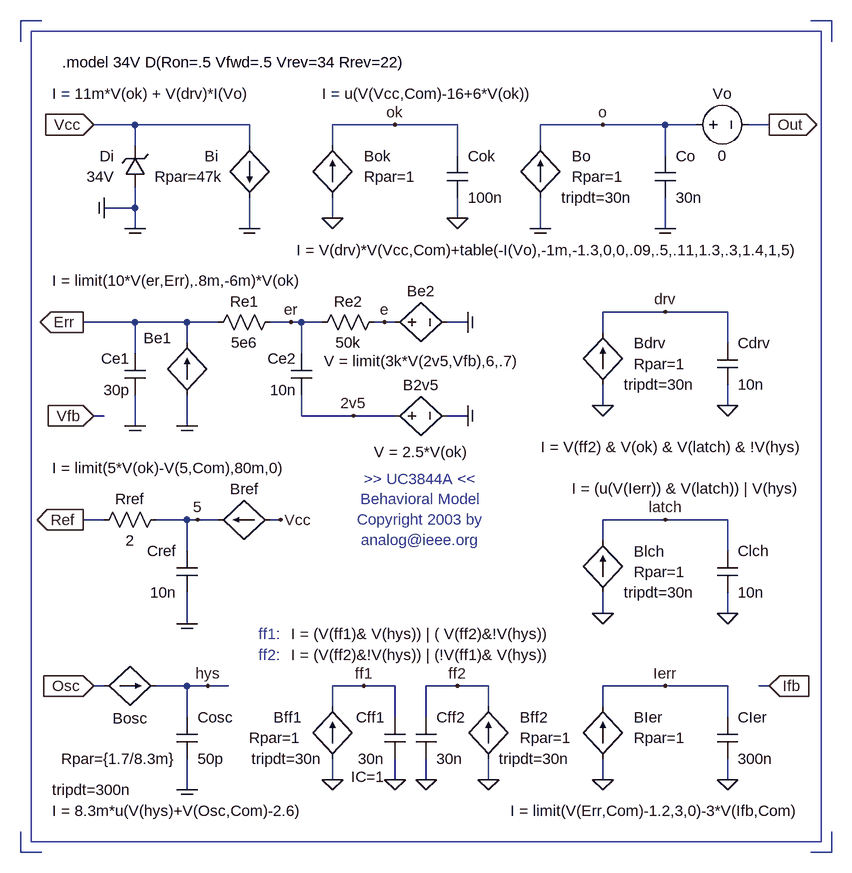
[diagram p0: schematic uc3844a.asc]
uc3844a.asc, the LTspice schematic file:
Version 4
SHEET 1 1792 932
WIRE -16 -208 16 -208
WIRE 496 96 592 96
WIRE -144 400 -144 352
WIRE -144 352 -192 352
WIRE -144 512 -144 464
WIRE 496 128 496 96
WIRE 496 208 496 240
WIRE 688 144 688 96
WIRE 688 240 688 208
WIRE 592 96 688 96
WIRE 80 -512 176 -512
WIRE 80 -480 80 -512
WIRE 80 -400 80 -368
WIRE 272 -464 272 -512
WIRE 272 -368 272 -400
WIRE 176 -512 272 -512
WIRE 496 -112 496 -80
WIRE 688 -176 688 -224
WIRE 688 -80 688 -112
WIRE 496 -224 592 -224
WIRE 496 -224 496 -192
WIRE 496 352 592 352
WIRE 496 384 496 352
WIRE 496 464 496 496
WIRE 688 400 688 352
WIRE 688 496 688 464
WIRE 592 352 688 352
WIRE -48 -512 -48 -480
WIRE -48 -400 -48 -352
WIRE -224 -480 -224 -512
WIRE -224 -512 -48 -512
WIRE -224 -416 -224 -384
WIRE -224 -512 -288 -512
WIRE -272 352 -288 352
WIRE -272 -384 -224 -384
WIRE 752 352 736 352
WIRE -272 96 -304 96
WIRE -144 96 -192 96
WIRE -144 144 -144 96
WIRE -144 256 -144 208
WIRE -288 -64 -272 -64
WIRE 752 -512 720 -512
WIRE 400 -480 400 -512
WIRE 400 -400 400 -352
WIRE 592 -224 688 -224
WIRE -144 -176 -144 -208
WIRE -144 -208 -224 -208
WIRE -144 -96 -144 -48
WIRE 32 -64 32 -96
WIRE 32 -160 32 -208
WIRE 144 -208 160 -208
WIRE 16 -208 32 -208
WIRE 32 -208 64 -208
WIRE -96 -208 -144 -208
WIRE 32 -64 112 -64
WIRE 256 -64 288 -64
WIRE 256 -208 288 -208
WIRE -400 -640 -400 -672
WIRE -400 -672 -368 -672
WIRE -400 576 -400 608
WIRE -400 608 -368 608
WIRE 816 608 848 608
WIRE 848 608 848 576
WIRE 816 -672 848 -672
WIRE 848 -672 848 -640
WIRE 592 -512 496 -512
WIRE 592 -464 592 -512
WIRE 592 -400 592 -352
WIRE -224 -160 -224 -208
WIRE -224 -208 -304 -208
WIRE -224 -96 -224 -48
WIRE 112 -64 176 -64
WIRE 640 -512 592 -512
WIRE 160 -208 176 -208
WIRE 496 -512 400 -512
WIRE -224 -384 -224 -352
WIRE -96 96 -128 96
WIRE -16 96 0 96
WIRE -144 352 -112 352
WIRE -128 96 -144 96
WIRE -112 352 -80 352
WIRE 80 384 80 352
WIRE 80 352 128 352
WIRE 176 352 176 400
WIRE 176 464 176 496
WIRE 80 496 80 464
WIRE 224 400 224 352
WIRE 224 352 272 352
WIRE 320 352 320 384
WIRE 272 352 320 352
WIRE 224 496 224 464
WIRE 320 496 320 464
WIRE 128 352 176 352
FLAG 16 -208 er
FLAG 592 96 latch
FLAG -112 352 hys
FLAG 496 240 0
FLAG 688 240 0
FLAG 176 -512 ok
FLAG 80 -368 0
FLAG 272 -368 0
FLAG 496 -80 0
FLAG 752 -512 Out
IOPIN 752 -512 Out
FLAG 688 -80 0
FLAG -288 -512 Vcc
IOPIN -288 -512 In
FLAG 592 352 Ierr
FLAG 496 496 0
FLAG 688 496 0
FLAG -304 96 Ref
IOPIN -304 96 Out
FLAG -288 352 Osc
IOPIN -288 352 In
FLAG -272 -384 Com
IOPIN -272 -384 In
FLAG 752 352 Ifb
IOPIN 752 352 In
FLAG -128 96 5
FLAG -304 -208 Err
IOPIN -304 -208 Out
FLAG -288 -64 Vfb
IOPIN -288 -64 In
FLAG 592 -224 drv
FLAG 112 -64 2v5
FLAG -144 512 COM
FLAG 496 -512 o
FLAG 160 -208 e
FLAG -224 -352 COM
FLAG 592 -352 COM
FLAG -224 -48 COM
FLAG -144 256 COM
FLAG 288 -208 COM
FLAG 288 -64 COM
FLAG -144 -48 COM
FLAG 400 -352 COM
FLAG 0 96 Vcc
FLAG -48 -352 COM
FLAG 80 496 0
FLAG 320 496 0
FLAG 224 496 0
FLAG 176 496 0
FLAG 128 352 ff1
FLAG 272 352 ff2
SYMBOL bi -144 -96 R180
WINDOW 0 24 88 Left 0
WINDOW 3 208 176 Right 0
SYMATTR InstName Be1
SYMATTR Value I = limit(10*V(er,Err),.8m,-6m)*V(ok)
SYMBOL bi -272 352 R270
WINDOW 0 -34 40 VBottom 0
WINDOW 3 -192 -80 VRight 0
WINDOW 123 -160 -80 VRight 0
SYMATTR InstName Bosc
SYMATTR Value I = 8.3m*u(V(hys)+V(Osc,Com)-2.6)
SYMATTR Value2 tripdt=300n
SYMBOL cap -160 400 R0
WINDOW 0 32 0 Left 0
WINDOW 3 32 64 Left 0
WINDOW 39 0 64 Right 0
SYMATTR InstName Cosc
SYMATTR Value 50p
SYMATTR SpiceLine Rpar={1.7/8.3m}
SYMBOL bi 496 -112 M180
WINDOW 0 48 64 Left 0
WINDOW 3 304 -96 Right 0
WINDOW 123 48 32 Left 0
WINDOW 39 32 0 Left 0
SYMATTR InstName Bdrv
SYMATTR Value I = V(ff2) & V(ok) & V(latch) & !V(hys)
SYMATTR Value2 Rpar=1
SYMATTR SpiceLine tripdt=30n
SYMBOL bi 496 208 M180
WINDOW 0 48 63 Left 0
WINDOW 3 304 160 Right 0
WINDOW 123 48 32 Left 0
WINDOW 39 32 0 Left 0
SYMATTR InstName Blch
SYMATTR Value I = (u(V(Ierr)) & V(latch)) | V(hys)
SYMATTR Value2 Rpar=1
SYMATTR SpiceLine tripdt=30n
SYMBOL cap 672 144 R0
WINDOW 0 32 0 Left 0
WINDOW 3 32 64 Left 0
SYMATTR InstName Clch
SYMATTR Value 10n
SYMBOL bi 80 -400 R180
WINDOW 0 -48 64 Right 0
WINDOW 3 16 160 Right 0
WINDOW 123 -48 32 Right 0
SYMATTR InstName Bok
SYMATTR Value I = u(V(Vcc,Com)-16+6*V(ok))
SYMATTR Value2 Rpar=1
SYMBOL cap 256 -464 R0
WINDOW 0 32 0 Left 0
WINDOW 3 32 64 Left 0
SYMATTR InstName Cok
SYMATTR Value 100n
SYMBOL cap 672 -176 R0
WINDOW 0 32 0 Left 0
WINDOW 3 32 64 Left 0
SYMATTR InstName Cdrv
SYMATTR Value 10n
SYMBOL bi 496 464 M180
WINDOW 0 48 64 Left 0
WINDOW 3 304 -80 Right 0
WINDOW 123 48 32 Left 0
SYMATTR InstName BIer
SYMATTR Value I = limit(V(Err,Com)-1.2,3,0)-3*V(Ifb,Com)
SYMATTR Value2 Rpar=1
SYMBOL cap 672 400 R0
WINDOW 0 32 0 Left 0
WINDOW 3 32 64 Left 0
SYMATTR InstName CIer
SYMATTR Value 300n
SYMBOL bi -48 -480 R0
WINDOW 0 -48 16 Right 0
WINDOW 3 -304 -80 Left 0
WINDOW 123 -40 48 Right 0
SYMATTR InstName Bi
SYMATTR Value I = 11m*V(ok) + V(drv)*I(Vo)
SYMATTR Value2 Rpar=47k
SYMBOL bi -16 96 R90
WINDOW 0 -32 40 VBottom 0
WINDOW 3 -80 336 VLeft 0
SYMATTR InstName Bref
SYMATTR Value I = limit(5*V(ok)-V(5,Com),80m,0)
SYMBOL res -176 80 R90
WINDOW 0 0 56 VBottom 0
WINDOW 3 32 56 VTop 0
SYMATTR InstName Rref
SYMATTR Value 2
SYMBOL cap -128 144 M0
WINDOW 0 32 0 Left 0
WINDOW 3 32 64 Left 0
SYMATTR InstName Cref
SYMATTR Value 10n
SYMBOL cap 48 -160 M0
SYMATTR InstName Ce2
SYMATTR Value 10n
SYMBOL bv 160 -208 R270
WINDOW 0 32 56 VTop 0
WINDOW 3 -44 56 VBottom 0
SYMATTR InstName Be2
SYMATTR Value V = limit(3k*V(2v5,Vfb),6,.7)
SYMBOL res 160 -224 R90
WINDOW 0 0 56 VBottom 0
WINDOW 3 32 56 VTop 0
SYMATTR InstName Re2
SYMATTR Value 50k
SYMBOL res 0 -224 R90
WINDOW 0 0 56 VBottom 0
WINDOW 3 32 56 VTop 0
SYMATTR InstName Re1
SYMATTR Value 5e6
SYMBOL bv 160 -64 R270
WINDOW 0 32 56 VTop 0
WINDOW 3 -40 56 VBottom 0
SYMATTR InstName B2v5
SYMATTR Value V = 2.5*V(ok)
SYMBOL zener -208 -416 R180
WINDOW 0 48 48 Left 0
WINDOW 3 48 16 Left 0
SYMATTR InstName Di
SYMATTR Value 34V
SYMBOL cap 576 -464 R0
WINDOW 0 32 0 Left 0
WINDOW 3 32 64 Left 0
SYMATTR InstName Co
SYMATTR Value 30n
SYMBOL cap -208 -160 M0
SYMATTR InstName Ce1
SYMATTR Value 30p
SYMBOL bi 400 -400 M180
WINDOW 0 48 64 Left 0
WINDOW 3 402 -81 Right 0
WINDOW 39 32 0 Left 0
WINDOW 123 48 32 Left 0
SYMATTR InstName Bo
SYMATTR Value I = V(drv)*V(Vcc,Com)+table(-I(Vo),-1m,-1.3,0,0,.09,.5,.11,1.3,.3,1.4,1,5)
SYMATTR SpiceLine tripdt=30n
SYMATTR Value2 Rpar=1
SYMBOL voltage 624 -512 R270
WINDOW 0 32 56 VTop 0
WINDOW 3 -32 56 VBottom 0
WINDOW 123 -32 56 VBottom 0
WINDOW 39 -32 56 VBottom 0
SYMATTR InstName Vo
SYMATTR Value 0
SYMBOL bi2 80 384 M0
WINDOW 123 16 80 Left 0
WINDOW 39 48 48 Left 0
WINDOW 0 48 16 Left 0
WINDOW 3 64 -112 Right 0
SYMATTR Value2 tripdt=30n
SYMATTR SpiceLine Rpar=1
SYMATTR InstName Bff1
SYMATTR Value I = (V(ff1)& V(hys)) | ( V(ff2)&!V(hys))
SYMBOL bi2 320 384 R0
WINDOW 123 16 80 Left 0
WINDOW 39 48 48 Left 0
WINDOW 0 48 16 Left 0
WINDOW 3 -304 -80 Left 0
SYMATTR Value2 tripdt=30n
SYMATTR SpiceLine Rpar=1
SYMATTR InstName Bff2
SYMATTR Value I = (V(ff2)&!V(hys)) | (!V(ff1)& V(hys))
SYMBOL cap 192 400 M0
WINDOW 0 32 0 Left 0
WINDOW 3 32 64 Left 0
WINDOW 123 32 92 Left 0
SYMATTR InstName Cff1
SYMATTR Value 30n
SYMATTR Value2 IC=1
SYMBOL cap 208 400 R0
WINDOW 0 32 0 Left 0
WINDOW 3 32 64 Left 0
SYMATTR InstName Cff2
SYMATTR Value 30n
TEXT -336 -608 Left 0 !.model 34V D(Ron=.5 Vfwd=.5 Vrev=34 Rrev=22)
TEXT 216 80 Center 0 ;>> UC3844A <<\nBehavioral Model\nCopyright 2003 by\nanalog@ieee.org
TEXT 0 272 Right 0 ;ff1:
TEXT 0 304 Right 0 ;ff2:
RECTANGLE Normal 832 592 -384 -656

The netlist it stands for:
* uc3844a.asc
Be1 Com Err I = limit(10*V(er,Err),.8m,-6m)*V(ok)
Bosc Osc hys I = 8.3m*u(V(hys)+V(Osc,Com)-2.6) tripdt=300n
Cosc hys Com 50p Rpar={1.7/8.3m}
Bdrv 0 drv I = V(ff2) & V(ok) & V(latch) & !V(hys) Rpar=1 tripdt=30n
Blch 0 latch I = (u(V(Ierr)) & V(latch)) | V(hys) Rpar=1 tripdt=30n
Clch latch 0 10n
Bok 0 ok I = u(V(Vcc,Com)-16+6*V(ok)) Rpar=1
Cok ok 0 100n
Cdrv drv 0 10n
BIer 0 Ierr I = limit(V(Err,Com)-1.2,3,0)-3*V(Ifb,Com) Rpar=1
CIer Ierr 0 300n
Bi Vcc Com I = 11m*V(ok) + V(drv)*I(Vo) Rpar=47k
Bref Vcc 5 I = limit(5*V(ok)-V(5,Com),80m,0)
Rref 5 Ref 2
Cref 5 Com 10n
Ce2 er 2v5 10n
Be2 e Com V = limit(3k*V(2v5,Vfb),6,.7)
Re2 e er 50k
Re1 er Err 5e6
B2v5 2v5 Com V = 2.5*V(ok)
Di Com Vcc 34V
Co o Com 30n
Ce1 Err Com 30p
Bo Com o I = V(drv)*V(Vcc,Com)+table(-I(Vo),-1m,-1.3,0,0,.09,.5,.11,1.3,.3,1.4,1,5) Rpar=1 tripdt=30n
Vo o Out 0
Bff1 0 ff1 I = (V(ff1)& V(hys)) | ( V(ff2)&!V(hys)) tripdt=30n Rpar=1
Bff2 0 ff2 I = (V(ff2)&!V(hys)) | (!V(ff1)& V(hys)) tripdt=30n Rpar=1
Cff1 ff1 0 30n IC=1
Cff2 ff2 0 30n
.model D D
.lib standard.dio
.model 34V D(Ron=.5 Vfwd=.5 Vrev=34 Rrev=22)
* >> UC3844A <<
* Behavioral Model
* Copyright 2003 by
* analog@ieee.org
* ff1:
* ff2:
.backanno
.end